# Altium project iF11K.PrjPcb
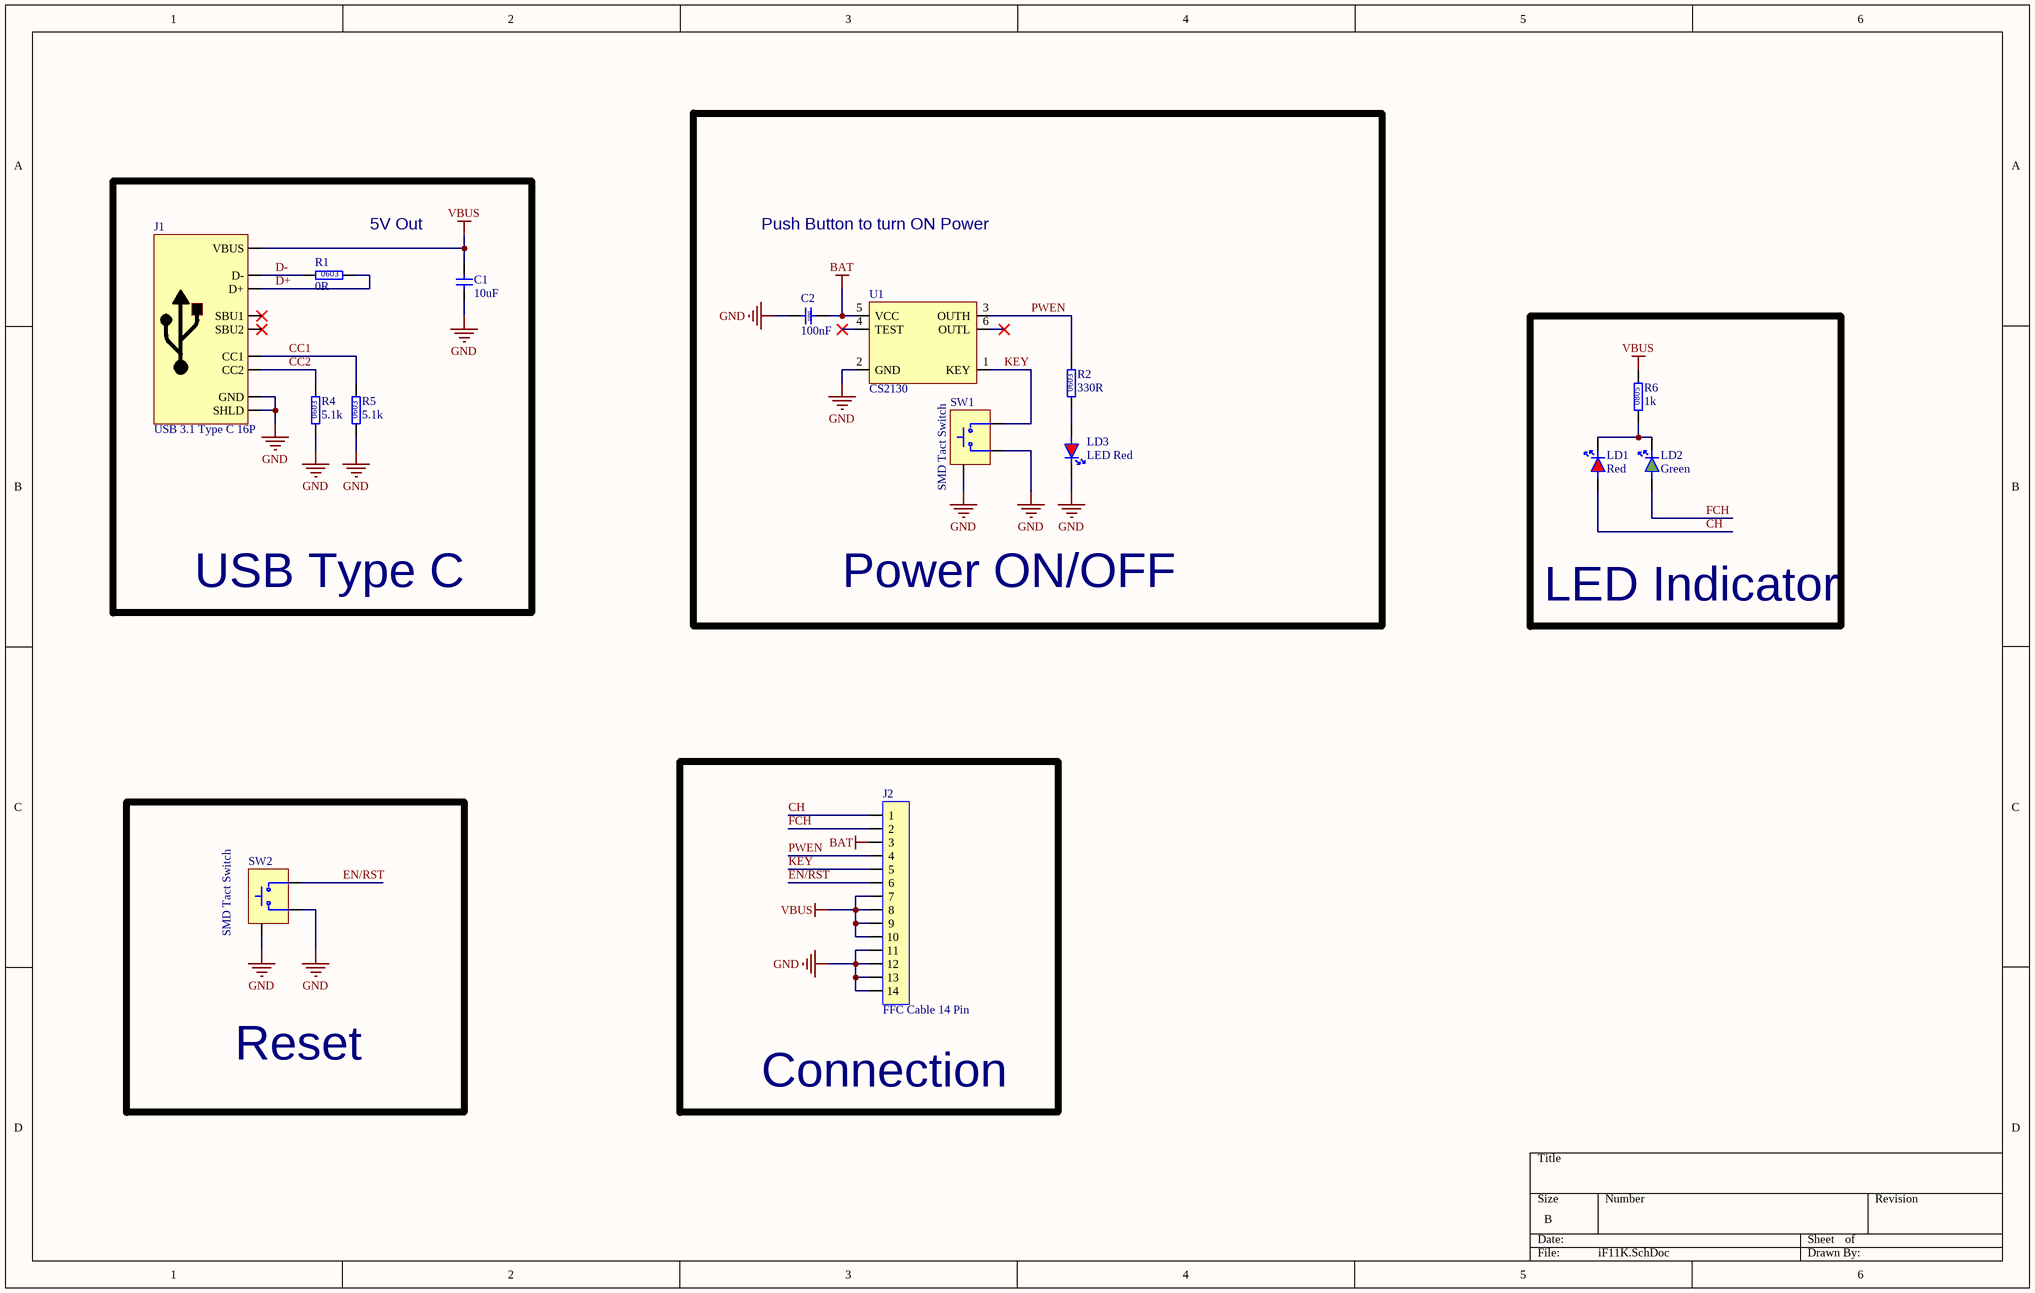
[diagram p0: iF11K.SchDoc]
1 sheet, 15 parts. Net scope: global (net labels, ports and power ports of the same name join across sheets).
Board file: iF11K.PcbDoc

## Sheet iF11K.SchDoc
size B; SheetNumber: 1; SheetTotal: 1

### Parts
C1  10uF  [C0603]
C2  100nF  [C0603]
J1  USB 3.1 Type C 16P  [USBC-16P -Upd]
J2  FFC Cable 14 Pin  [FFC-14-1.25mm]
LD1  Red  [LED 3mm RED]
LD2  Green  [LED-0603-GREEN]
LD3  LED Red  [LED 3mm RED]
R1  0R  [R0603-LD]
R2  330R  [R0603-LD]
R4  5.1k  [R0603-LD]
R5  5.1k  [R0603-LD]
R6  1k  [R0805-LD]
SW1  SMD Tact Switch  [Light button]
SW2  SMD Tact Switch  [Light button]
U1  CS2130  [SOT23-6]

### Blocks framed on the sheet
Power ON/OFF: C2 LD3 R2 SW1 U1
USB Type C: C1 J1 R1 R4 R5
LED Indicator: LD1 LD2 R6
Connection: J2
Reset: SW2

### Nets
BAT: C2.1 J2.3 U1.5(VCC)
GND: C1.1 C2.2 J1.1(GND) J1.10(SHLD) J2.11 J2.12 J2.13 J2.14 LD3.2(K) R4.1 R5.1 SW1.1 SW1.3 SW2.1 SW2.3 U1.2(GND)
VBUS: C1.2 J1.2(VBUS) J2.7 J2.8 J2.9 J2.10 R6.2
CC1: J1.4(CC1) R5.2
CC2: J1.8(CC2) R4.2
CH: J2.1 LD1.1(A)
D+: J1.6(D+) R1.2
D-: J1.5(D-) R1.1
EN/RST: J2.6 SW2.2
FCH: J2.2 LD2.1(A)
KEY: J2.5 SW1.2 U1.1(KEY)
PWEN: J2.4 R2.2 U1.3(OUTH)
NetLD1_2: LD1.2(K) LD2.2(K) R6.1
NetLD3_1: LD3.1(A) R2.1

Not connected (* = marked no-connect by the designer): J1 3(SBU2)* 7(SBU1)*; U1 4(TEST)* 6(OUTL)*

### Notes on the sheet
- 5V Out
- Push Button to turn ON Power
- (in symbol C 0603 100nF 50V) 0603
- (in symbol R 0603 0R) 0603
- (in symbol R 0603 5.1k) 0603
- (in symbol R 0603 330R) 0603
- (in symbol R 0805 1k) 0805

### Library data of the parts
C1 = Capacitor: 0603 Package 25V; Part No: *; Product Code: *; Suppliers: 南京南山半导体有限公司; Manufacturer: *
C2 = C 0603 100nF 50V: 10% 50V; Part No: W-T-CA-X703N100K50VNT; Manufacturer: FENGHUA; Material Name: 贴片电容0603 100NF/50V 10%; Product Code: WP0002721; Supplier: 南京南山半导体有限公司
J1 = USB-C-16P: TYPE-C 16PIN L8.35; Part No: W-T-CN-TYPE-C 16P; Material Name: USB插座/TYPE-C 16P; Product Code: WP0003709; Supplier: 奥科成电子有限公司
J2 = FFC14P
LD1 = LED Red: Part No: *; Product Code: *; Suppliers: *; Manufacturer: *
LD2 = LED Green: Part No: *; Product Code: *; Suppliers: *; Manufacturer: *
R1 = R 0603 0R: 5%; Part No: W-T-RE-RS03K0RJT; Manufacturer: 贴片; Material Name: 贴片电阻0603 0Ω 5%; Product Code: WP0002766; Supplier: 南京南山半导体有限公司
R2 = R 0603 330R: 5%; Part No: W-T-RE-RS03K331JT; Material Name: 贴片电阻0603 330Ω 5%; Product Code: WP0003776; Supplier: 南京南山半导体有限公司
R4 R5 = R 0603 5.1k: 5%; Part No: W-T-RE-RS03K512JT; Material Name: 贴片电阻0603 5.1K 5%; Product Code: WP0002939; Supplier: 南京南山半导体有限公司
R6 = R 0805 1k: 5%; Part No: W-T-RE-RS05K121JT; Material Name: 贴片电阻0805 120Ω 5%; Product Code: WP0002857; Supplier: 南京南山半导体有限公司
SW1 SW2 = soft tact switch
U1 = CS2130: Single-button switch IC
LD3 = LED Red: Part No: *; Product Code: *; Suppliers: *; Manufacturer: *